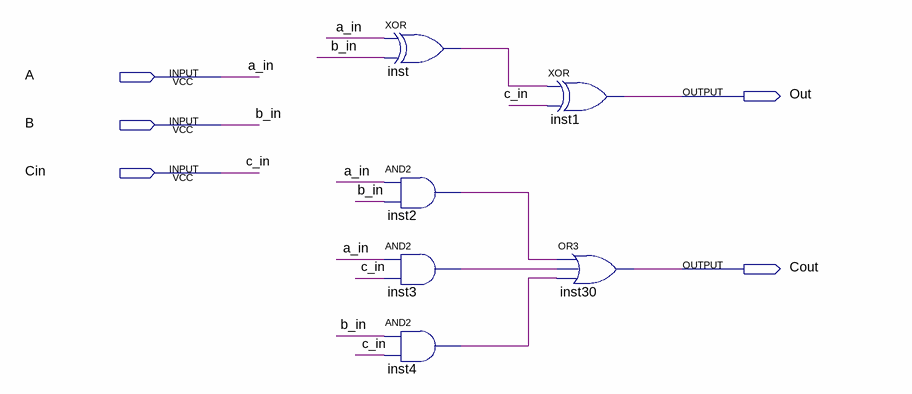
[diagram p0: schematic sheet]
// Quartus schematic full_bit_adder.bdf as structural Verilog: 6 symbols, 5 pins
module full_bit_adder (
  input  A,
  input  B,
  input  Cin,
  output Out,
  output Cout
);

  wire inst2_out, inst3_out, inst4_out, inst_out;

  xor inst (inst_out, A, B);
  and inst2 (inst2_out, A, B);
  and inst3 (inst3_out, A, Cin);
  and inst4 (inst4_out, B, Cin);
  xor inst1 (Out, inst_out, Cin);
  or inst30 (Cout, inst2_out, inst3_out, inst4_out);

  // Other names for the same wires on the sheet: a_in = A; b_in = B; c_in = Cin
endmodule
